# EAGLE design sc_v1 (EAGLE 9.6.2)
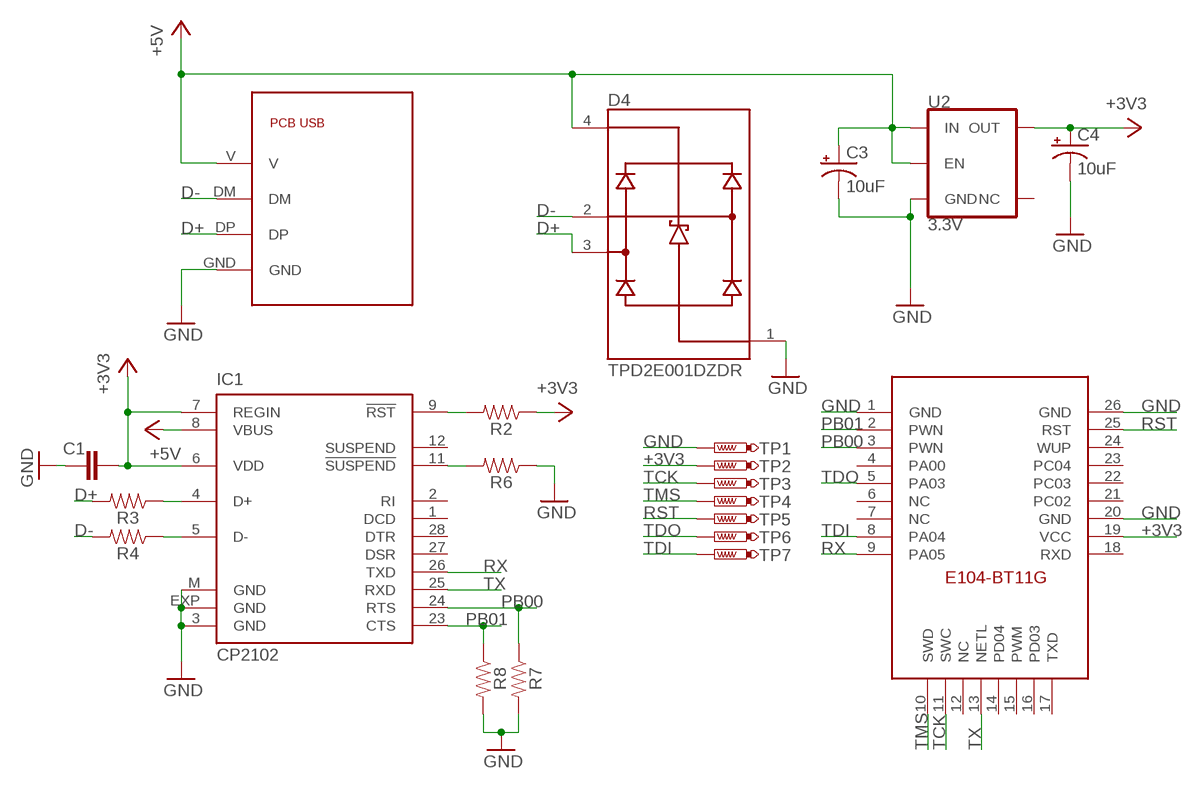
[diagram p0: schematic, sheet 1]

## Parts
C1  100nf  CAP0402  [CAPC1005X40N]
C3  10uF  10UF-POLAR-0603-6.3V-20%(TANT)  [0603-POLAR]
C4  10uF  10UF-POLAR-0603-6.3V-20%(TANT)  [0603-POLAR]
D4  TPD2E001DZDR  [SOT192P237X122-4N]
IC1  CP2102  [MLP28]
R2  4.7k  RESISTOR0402  [0402]
R3  30Ohm  RESISTOR0402  [0402]
R4  30Ohm  RESISTOR0402  [0402]
R6  10k  RESISTOR0402  [0402]
R7  10k  RESISTOR0402  [0402]
R8  10k  RESISTOR0402  [0402]
TP1  PTR1TP10R  [TP10R]
TP2  PTR1TP10R  [TP10R]
TP3  PTR1TP10R  [TP10R]
TP4  PTR1TP10R  [TP10R]
TP5  PTR1TP10R  [TP10R]
TP6  PTR1TP10R  [TP10R]
TP7  PTR1TP10R  [TP10R]
U2  3.3V  V_REG_AP2112K-3.3V  [SOT23-5]
U$1  E104-BT11G-PCBPCB  [E104-BT11G-PCB]
U$2  PCB_USBNOBACK  [PCB_USB]

## Nets
+3V3: C1.2 C4.+ IC1.6(VDD) IC1.7(REGIN) R2.1 TP2.TP U2.5(OUT) U$1.19(VCC)
+5V: C3.+ D4.4(VCC) IC1.8(VBUS) U2.1(IN) U2.3(EN) U$2.V
D+: D4.3(IO2) R3.2 U$2.DP
D-: D4.2(IO1) R4.2 U$2.DM
GND: C1.1 C3.- C4.- D4.1(GND) IC1.3(GND) IC1.EXP(GND) IC1.M(GND) R6.1 R7.2 R8.2 TP1.TP U2.2(GND) U$1.1(GND) U$1.20(GND) U$1.26(GND) U$2.GND
N$1: IC1.4(D+) R3.1
N$2: IC1.5(D-) R4.1
N$3: IC1.9(!RST) R2.2
N$5: IC1.11(!SUSPEND) R6.2
PB00: IC1.24(RTS) R7.1 U$1.3(PWN)
PB01: IC1.23(CTS) R8.1 U$1.2(PWN)
RST: TP5.TP U$1.25(RST)
RX: IC1.26(TXD) U$1.9(PA05)
TCK: TP3.TP U$1.11(SWC)
TDI: TP7.TP U$1.8(PA04)
TDO: TP6.TP U$1.5(PA03)
TMS: TP4.TP U$1.10(SWD)
TX: IC1.25(RXD) U$1.13(NETL)
Unconnected: IC1.1(DCD) IC1.2(RI) IC1.12(SUSPEND) IC1.27(DSR) IC1.28(DTR) U2.4(NC) U$1.4(PA00) U$1.6(NC) U$1.7(NC) U$1.12(NC) U$1.14(PD04) U$1.15(PWM) U$1.16(PD03) U$1.17(TXD) U$1.18(RXD) U$1.21(PC02) U$1.22(PC03) U$1.23(PC04) U$1.24(WUP)

## Library data of the parts
C1 = discretes-dev:CAP0402: CAP, 0402; AVAILABILITY: Good; DESCRIPTION: RESISTOR, 0402 0.063W 1% 3M6; Resistance:3.6Mohm; Resistance Tolerance:± 1%; Power Rating:0.063W; Voltage Rating:50V; Series:RC32H; Temperature Coefficient:± 100ppm/°C; Resistor Element Type:Thick Film; Resistor Case Style:0402; No. of Pins:2; SVHC:No SVHC; Case Style:0402; External Length / Height:1mm; Temperature Coeff. +:100ppm/°C; Temperature Coeff. -:100ppm/°C; External Depth:0.35mm; External Width:0.5mm; Operating Temperature Range:-55°C to +155°C; Overload Voltage:100V; MF: Yageo; MP: RC0402FR-073M6L; PACKAGE: 1005 Panasonic Electronic Components; PRICE: None; PURCHASE-URL: https://pricing.snapeda.com/search/part/RC0402FR-073M6L/?ref=eda
C3 C4 = SparkFun-Capacitors:10UF-POLAR: 10.0µF polarized capacitors A capacitor is a passive two-terminal electrical component used to store electrical energy temporarily in an electric field.; PROD_ID: CAP-13210
D4 = TPD2E001DZDR:TPD2E001DZDR: Low-capacitance 2-channel +/-15k-V ESD protection array for high-speed data interfaces Check prices <https://pricing.snapeda.com/parts/TPD2E001DZDR/Texas%20Instruments/view-part?ref=eda>; AVAILABILITY: In Stock; DESCRIPTION: Low-capacitance 2-channel +/-15k-V ESD protection array for high-speed data interfaces 4-SOT-23 -40 to 85; MF: Texas Instruments; MP: TPD2E001DZDR; PACKAGE: SOT-23-4 Texas Instruments; PRICE: None; PURCHASE-URL: https://pricing.snapeda.com/search/part/TPD2E001DZDR/?ref=eda
IC1 = silabs:CP210*: Single-Chip USB to UART Bridge Source: www.silabs.com .. CP2101.pdf / cp2102.pdf; MF: FARNELL; MPN: CP2102-GM; OC_FARNELL: 9282130; OC_NEWARK: 30K5635
R2-R4 R6-R8 = SparkFun-Resistors:RESISTOR: Generic Resistor Package
TP1-TP7 = testpad:PTR1: TEST PIN
U2 = SparkFun-IC-Power:V_REG_AP2112: AP2112 - 600mA CMOS LDO Regulator w/ Enable The AP2112 is CMOS process low dropout linear regulator with enable function, the regulator delivers a guaranteed 600mA (min.) continuous load current. Features Output Voltage Accuracy: ±1.5% Output Current: 600mA (Min.) Foldback Short Current Protection: 50mA Enable Function to Turn ON/OFF VOUT Low Dropout Voltage (3.3V): 250mV (Typ.) @IOUT=600mA Excellent Load Regulation: 0.2%/A (Typ.) Excellent Line Regulation: 0.02%/V (Typ.) Low Quiescent Current: 55μA (Typ.) Low Standby Current: 0.01μA (Typ.) Low Output Noise: 50μVRMS PSRR: 100Hz -65dB, 1kHz -65dB OTSD Protection Stable with 1.0μF Flexible Cap: Ceramic, Tantalum and Aluminum Electrolytic Operation Temperature Range: -40°C to 85°C ESD: MM 400V, HBM 4000V; PROD_ID: VREG-12457
U$1 = E104-BT11G-PCB:E104-BT11G-PCB
U$2 = pcb_usb:PCB_USB

## Board
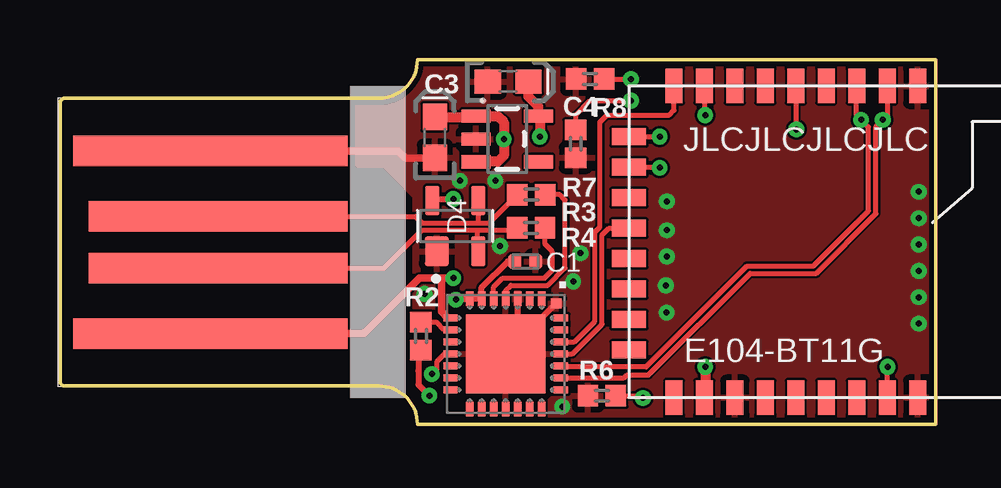
[diagram p1: board, top side]
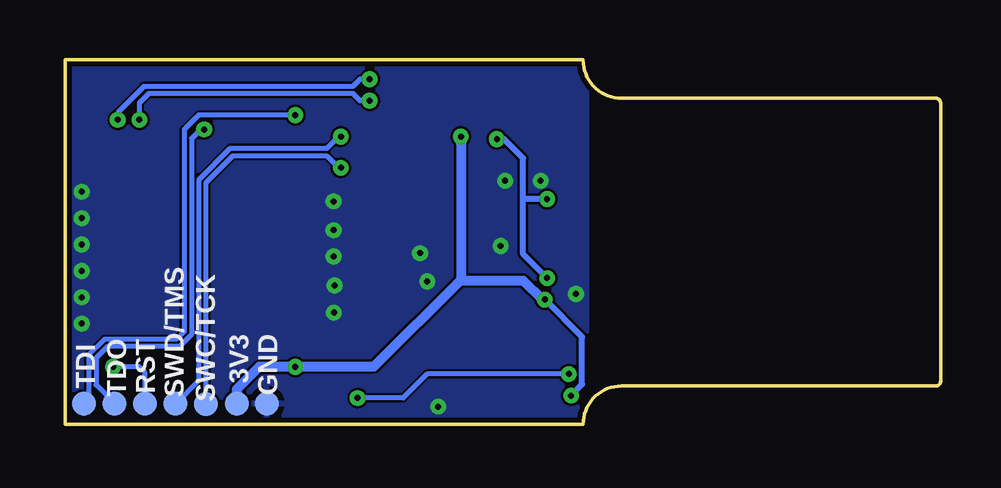
[diagram p2: board, bottom side, seen from below]

Size 36.5 x 15.2 mm. Coordinates in mm from the lower left corner, seen from the top.
Outline: 36.5,15.2 14.9,15.2 arc-90 13.3,13.6 0.2,13.6 arc90 0,13.4 0,1.8 arc90 0.2,1.6 13.3,1.6 arc-90 14.9,0 36.5,0 36.5,15.2
Copper layers (1*16): Top 0.035mm / dielectric 1.5mm / Bottom 0.035mm
Design rules "default": minimum track width 0.2mm, minimum drill 0.25mm, track to track 4mil, track to pad 4mil, pad to pad 4mil, via to via 4mil, smd to smd 4mil, copper to edge 0.2mm, drill to drill 0.25mm, minimum pad ring 10mil, minimum via ring 8mil, stop-mask expansion 2mil, vias tented up to drill 0.3mm, thermal gap 10mil

### Footprints (pad centres in the part's own frame; a part is rotated, then mirrored left to right if it is on the bottom)
CAPC1005X40N = smd 0.54 x 0.6: 1 -0.432,0; 2 0.432,0
0603-POLAR = smd 1.1 x 1: + 0.85,0; - -0.85,0
SOT192P237X122-4N = smd 1.24 x 0.99: 1 -1.055,0.76 | smd 1.24 x 0.59: 2 -1.055,-0.96; 3 1.055,-0.96; 4 1.055,0.96
MLP28 = smd 0.6 x 0.3: 1 -2.3,1.5; 2 -2.3,1; 3 -2.3,0.5; 4 -2.3,0; 5 -2.3,-0.5; 6 -2.3,-1; 7 -2.3,-1.5; 15 2.3,-1.5; 16 2.3,-1; 17 2.3,-0.5; 18 2.3,0; 19 2.3,0.5; 20 2.3,1; 21 2.3,1.5 | smd 0.3 x 0.6: 8 -1.5,-2.3; 9 -1,-2.3; 10 -0.5,-2.3; 11 0,-2.3; 12 0.5,-2.3; 13 1,-2.3; 14 1.5,-2.3; 22 1.5,2.3; 23 1,2.3; 24 0.5,2.3; 25 0,2.3; 26 -0.5,2.3; 27 -1,2.3; 28 -1.5,2.3 | smd 3.3 x 3.3: EXP 0,0 | smd 0.435 x 0.435: M -2.103,2.103
0402 = smd 0.85 x 0.9: 1 -0.58,0; 2 0.58,0
TP10R = smd 1 x 1: TP 0,0
SOT23-5 = smd 0.55 x 1.2: 1 -0.95,-1.3; 2 0,-1.3; 3 0.95,-1.3; 4 0.95,1.3; 5 -0.95,1.3
E104-BT11G-PCB = smd 1.422 x 0.711: 1 -0.043,12.039; 2 -0.043,10.769; 3 -0.043,9.499; 4 -0.043,8.229; 5 -0.043,6.959; 6 -0.043,5.689; 7 -0.043,4.419; 8 -0.043,3.149; 9 -0.043,1.879; 18 12.954,1.879; 19 12.954,3.149; 20 12.954,4.419; 21 12.954,5.689; 22 12.954,6.959; 23 12.954,8.229; 24 12.954,9.499; 25 12.954,10.769; 26 12.954,12.039 | smd 0.711 x 1.422: 10 2.079,0; 11 3.349,0; 12 4.619,0; 13 5.889,0; 14 7.159,0; 15 8.429,0; 16 9.699,0; 17 10.969,0
PCB_USB = smd 1.27 x 10.8: DM 2.731,6.668; DP 4.889,6.668 | smd 1.27 x 11.43: GND 7.62,6.985; V 0,6.985

### Placement (x,y rotation side)
C1  19.4,6.8 180 top
C3  15.63,11.97 90 top
C4  18.68,14.29 0 top
D4  16.48,8.28 90 top
IC1  18.58,2.94 270 top
R2  15.05,3.68 90 top
R3  19.65,9.58 180 top
R4  19.64,8.2 180 top
R6  22.59,1.2 0 top
R7  21.5,11.7 270 top
R8  22.1,14.4 180 top
TP1  28.09,0.86 0 bottom
TP2  29.34,0.86 0 bottom
TP3  30.62,0.85 0 bottom
TP4  31.89,0.86 0 bottom
TP5  33.16,0.88 0 bottom
TP6  34.43,0.86 0 bottom
TP7  35.71,0.86 0 bottom
U2  18.65,11.9 270 top
U$1  23.72,14.07 270 top
U$2  13.26,3.79 90 top

### Tracks (layer width: path | path; a pad name or v marks a point on that pad's centre or on a via)
+3V3  (via drill 0.25)
  Top 0.254: v16.5,5.2 16.54,5.24 IC1.7 IC1.6 17.58,5.71 18.67,6.8 C1.2 | R2.1 14.95,3 14.95,2.23 14.94,2.23 14.94,1.66 v15.4,1.2
  Top 0.406: C4.+ 19.53,13.67 19.95,13.25 U2.5 20,12.8 v20,12 | v26.9,2.4 26.9,1.15 U$1.19
  Bottom 0.254: v15.4,1.2 15.4,1.21 14.94,1.67 14.94,3.64 v16.5,5.2
  Bottom 0.406: v20,12 20,6.03 | 20,6.03 20,6 17.4,6 16.6,5.2 v16.5,5.2 | 20,6.03 23.62,2.41 v26.89,2.41 v26.9,2.4 28.4,2.4 29.34,1.47 TP2.TP
+5V  (via drill 0.25)
  Top 0.254: D4.4 15.59,9.4 v16.4,9.4
  Top 0.305: U$2.V 12.67,3.79 14.98,6.1 15.9,6.1 | 15.9,6.1 v16.4,6.1 | 15.9,6.1 15.9,4.7 16.16,4.44 IC1.8
  Top 0.406: C3.+ 17.32,12.82 U2.1 18.25,12.85 18.5,12.6 v18.5,11.9 18.5,11.2 18.25,10.95 U2.3
  Bottom 0.254: 17.4,9.4 17.4,7.1 v16.4,6.1 | 17.4,9.4 17.4,11.1 18.2,11.9 v18.5,11.9 | v16.4,9.4 17.4,9.4
D+
  Top 0.2: 17.5,8.4 15.1,8.4 14.82,8.68 U$2.DP | 17.5,8.4 17.89,8.4 R3.2 | D4.3 17.44,8.46 17.5,8.4
D-
  Top 0.2: R4.2 18.96,8.1 17.4,8.1 | 17.4,8.1 15.1,8.1 13.52,6.52 U$2.DM | D4.2 17.4,7.25 17.4,8.1
GND  (via drill 0.25)
  Top 0.254: IC1.3 19.08,3.9 19.21,3.9 | 19.21,3.9 19.21,3.57 IC1.EXP | IC1.M 19.54,3.9 19.21,3.9
  Top 0.305: U$2.GND 14.09,11.41 14.4,11.1 15.61,11.1 C3.-
  other vias: 18.34,7.44 25.29,4.66 25.26,5.79 25.3,7 35.8,9.7 35.8,8.6 35.8,7.5 35.8,6.4 35.8,5.3 35.8,4.2 25.3,8.1 25.3,9.3 21.4,5.96 20.94,0.74 18.15,10.16 16.67,10.16 21.7,7.14 15.2,5.44
  pour Bottom: 14.76,-0.1 36.89,-0.1 36.89,15.38 14.76,15.38
  pour Top: 12.4,15.5 36.9,15.5 36.9,-0.1 14.8,-0.1 14.8,9.5 13.5,10.8 12.4,10.8
N$1
  Top 0.2: IC1.4 18.58,5.58 18.8,5.8 20.34,5.8 21.06,6.52 21.06,9.36 20.84,9.58 R3.1
N$2
  Top 0.2: IC1.5 18.08,5.73 18.45,6.1 20.2,6.1 20.53,6.43 20.53,7.21 20.22,7.52 R4.1
N$3
  Top 0.2: IC1.9 16.01,3.94 15.69,4.26 R2.2
N$5  (via drill 0.25)
  Top 0.2: IC1.11 16.04,2.94 15.7,2.6 15.7,2.3 v15.5,2.1 | R6.2 24.2,1.2 v24.3,1.1
  Bottom 0.2: v15.5,2.1 21.4,2.1 22.4,1.1 v24.3,1.1
PB00  (via drill 0.25)
  Top 0.2: U$1.3 33.2,14.1 33.2,12.9 v33.4,12.7 33.7,12.4 33.7,8.9 31.4,6.6 28.64,6.6 24.43,2.39 20.93,2.39 IC1.24 | R7.1 21.5,12.9 22.1,13.5 v23.8,13.5
  Bottom 0.2: v23.8,13.5 24.2,13.5 24.5,13.8 33,13.8 33.4,13.4 v33.4,12.7
PB01  (via drill 0.25)
  Top 0.2: U$1.2 34.5,14.1 34.5,12.9 v34.3,12.7 34.02,12.42 34.02,8.79 31.53,6.3 28.77,6.3 24.54,2.06 23.64,2.06 23.52,1.94 IC1.23 | R8.1 v23.8,14.4
  Bottom 0.2: v23.8,14.4 24.2,14.4 24.5,14.1 33.2,14.1 34.3,13 v34.3,12.7
RST  (via drill 0.25)
  Top 0.2: U$1.25 34.49,2.39 v34.5,2.4
  Bottom 0.2: TP5.TP 33.16,2.17 33.4,2.4 v34.5,2.4
RX
  Top 0.2: IC1.26 21.44,3.44 22.3,4.3 22.3,8.02 22.5,8.22 22.5,12.6 22.8,12.9 25.4,12.9 25.6,13.1 U$1.9
TCK  (via drill 0.25)
  Top 0.2: U$1.11 24.98,10.72 v25,10.7
  Bottom 0.2: TP3.TP 30.62,10.08 29.5,11.2 25.6,11.2 25.1,10.7 v25,10.7
TDI  (via drill 0.25)
  Top 0.2: U$1.8 26.87,12.93 v26.9,12.9
  Bottom 0.2: TP7.TP 35.51,1.06 35.51,2.89 34.85,3.55 31.85,3.55 31.53,3.87 31.53,12.3 30.93,12.9 v26.9,12.9
TDO  (via drill 0.25)
  Top 0.2: U$1.5 30.68,12.3 v30.7,12.3
  Bottom 0.2: v30.7,12.3 30.85,12.3 31.23,11.93 31.23,3.74 31.72,3.25 34.72,3.25 35.21,2.76 35.21,1.64 TP6.TP
TMS  (via drill 0.25)
  Top 0.2: U$1.10 v24.99,11.99 v25,12
  Bottom 0.2: v25,12 25.1,12 25.58,11.52 29.61,11.52 30.93,10.2 30.93,1.83 TP4.TP
TX
  Top 0.2: U$1.13 22.89,8.18 22.6,7.9 22.6,4.17 21.37,2.94 IC1.25

### Text on the board
tNames: C3 | C4 | JLCJLCJLCJLC | . | E104-BT11G
bNames: SWC/TCK | SWD/TMS | GND | 3V3 | RST | TDO | TDI